# Altium schematic sheet AUAV-X1_POWER_R1.SchDoc
size A4; PageSetup: Record=PageOptions|CenterHorizontal=True|CenterVertical=True|PrintScale=0.97|XCorrection=1.00|YCorrection=1.00|PrintKind=2|BorderSize=5000000|LeftOffset=0|BottomOffset=0|Orientation=2|PaperLength=1000|PaperWidth=1000|Scale=100|PaperSource=267|PrintQuality=-4|MediaType=1|DitherType=1|PaperKind=A4|PrintScaleMode=1
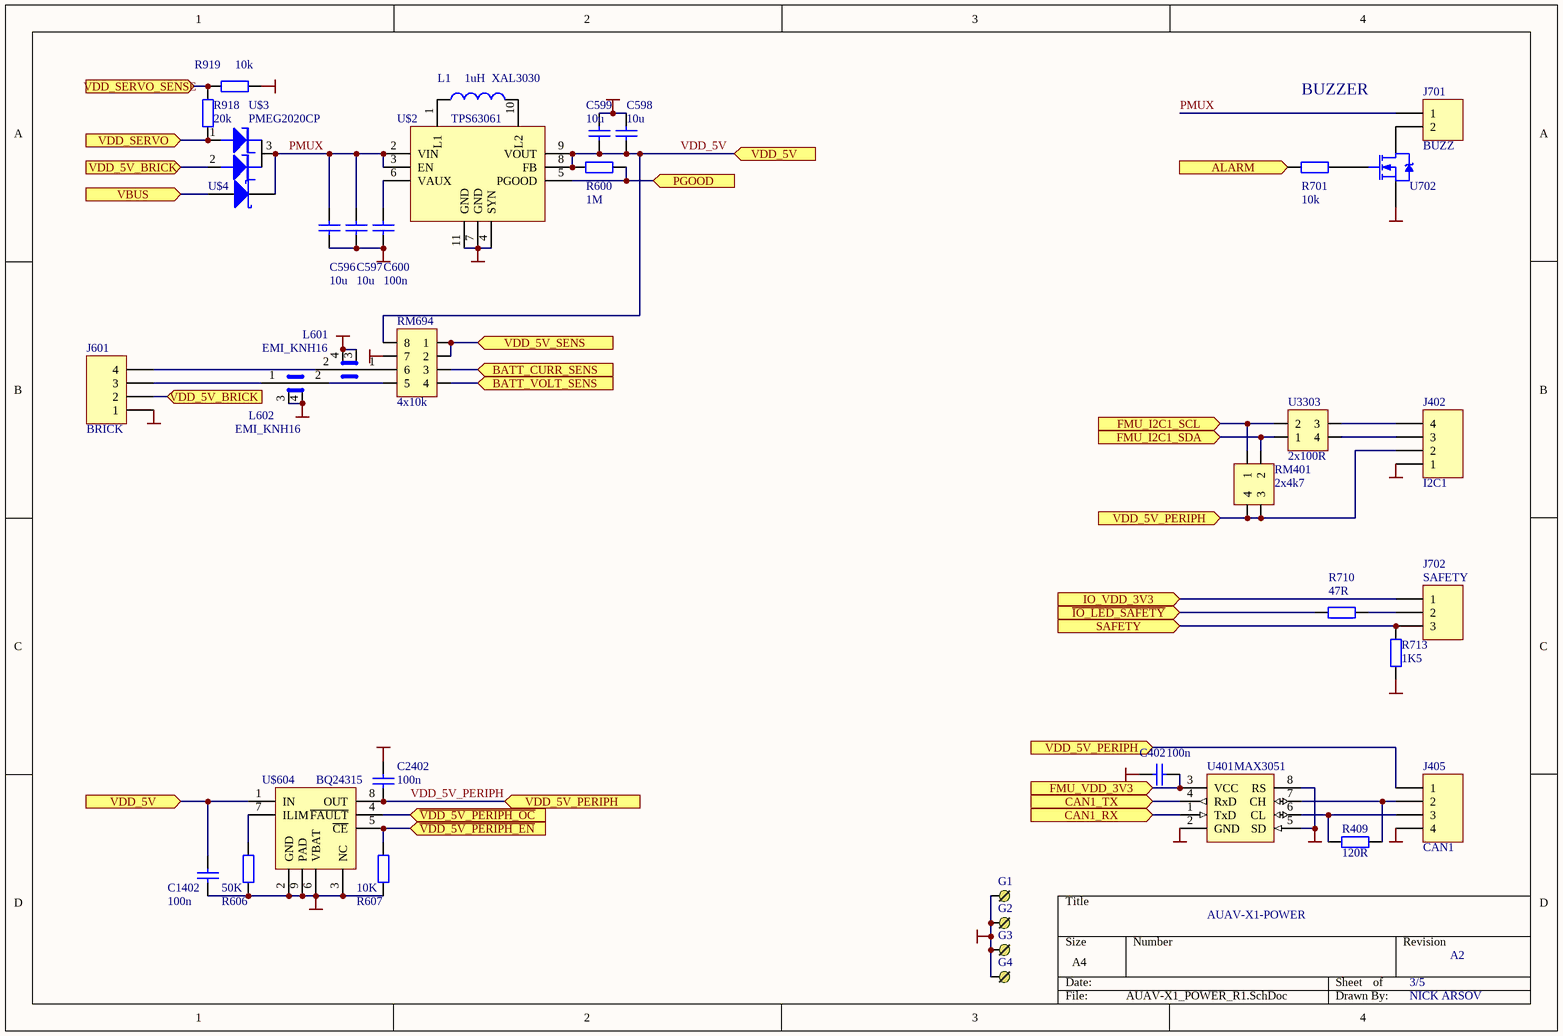
[diagram p0: AUAV-X1_POWER_R1.SchDoc]

## Parts
C402  100n  [0402A]
C596  10u  [0805A]
C597  10u  [0805A]
C598  10u  [0805A]
C599  10u  [0805A]
C600  100n  [0402A]
C1402  100n  [0402A]
C2402  100n  [0402A]
G1  PLUG  [SMT_PAD_ROUND]  (value not drawn)
G2  PLUG  [SMT_PAD_ROUND]  (value not drawn)
G3  PLUG  [SMT_PAD_ROUND]  (value not drawn)
G4  PLUG  [SMT_PAD_ROUND]  (value not drawn)
J402  I2C1  [HDR1X4]
J405  CAN1  [HDR1X4]
J601  BRICK  [HDR1X4]
J701  BUZZ  [HDR1X2]
J702  SAFETY  [HDR1X3]
L1  XAL3030  value 1uH  [XAL4040]
L601  EMI_KNH16  [EMI_KNH16_0603]
L602  EMI_KNH16  [EMI_KNH16_0603]
R409  120R  [0603A]
R600  1M  [0402A]
R606  50K  [0402A]
R607  10K  [0402A]
R701  10k  [0402A]
R710  47R  [0402A]
R713  1K5  [0402A]
R918  20k  [0402A]
R919  10k  [0402A]
RM401  2x4k7  [RM2_0804]
RM694  4x10k  [RM4_0804]
U401  MAX3051  [SOT-23-8]
U702  ZXMN2F34MA  [2N7002-SOT323]  (value not drawn)
U3303  2x100R  [RM2_0804]
U$2  TPS63061  [TPS63061]
U$3  PMEG2020CP  [pmeg2020cp]
U$4  D Schottky  [SOD323F]  (value not drawn)
U$604  BQ24315  [BQ24315]

## Ports
ALARM, BATT_CURR_SENS, BATT_VOLT_SENS, CAN1_RX, CAN1_TX, FMU_I2C1_SCL, FMU_I2C1_SDA, FMU_VDD_3V3, IO_VDD_3V3, PGOOD, SAFETY, VBUS, VDD_5V, VDD_5V_BRICK, VDD_5V_PERIPH, VDD_5V_SENS, VDD_SERVO, VDD_SERVO_SENSE, ~{IO_LED_SAFETY}, ~{VDD_5V_PERIPH_EN}, ~{VDD_5V_PERIPH_OC}

## Nets
GND: C402.1 C596.1 C597.1 C598.1 C599.1 C600.1 C1402.1 C2402.1 G1.1 G2.1 G3.1 G4.1 J402.1 J405.4 J601.1 L601.3(G) L601.4(G) L602.3(G) L602.4(G) R606.1 R607.1 R713.2 R919.2 RM694.7 U401.2(GND) U401.5(SD) U401.8(RS) U702.2(S) U$2.4(SYN) U$2.7(GND) U$2.11(GND) U$604.2(GND) U$604.3(NC) U$604.6(VBAT) U$604.9(PAD)
~{IO_LED_SAFETY}: R710.2 ; port ~{IO_LED_SAFETY}
~{VDD_5V_PERIPH_EN}: R607.2 U$604.5(~{CE}) ; port ~{VDD_5V_PERIPH_EN}
~{VDD_5V_PERIPH_OC}: U$604.4(~{FAULT}) ; port ~{VDD_5V_PERIPH_OC}
ALARM: R701.1 ; port ALARM
BATT_CURR_SENS: RM694.3 ; port BATT_CURR_SENS
BATT_VOLT_SENS: RM694.4 ; port BATT_VOLT_SENS
CAN1_RX: U401.1(TxD) ; port CAN1_RX
CAN1_TX: U401.4(RxD) ; port CAN1_TX
FMU_I2C1_SCL: RM401.1 U3303.2 ; port FMU_I2C1_SCL
FMU_I2C1_SDA: RM401.2 U3303.1 ; port FMU_I2C1_SDA
FMU_VDD_3V3: C402.2 U401.3(VCC) ; port FMU_VDD_3V3
IO_VDD_3V3: J702.1 ; port IO_VDD_3V3
PGOOD: R600.2 U$2.5(PGOOD) ; port PGOOD
PMUX: C596.2 C597.2 J701.1 U$2.2(VIN) U$2.3(EN) U$3.3 U$4.2(K)
SAFETY: J702.3 R713.1 ; port SAFETY
VBUS: U$4.1(A) ; port VBUS
VDD_5V: C598.2 C599.2 C1402.2 R600.1 RM694.8 U$2.8(FB) U$2.9(VOUT) U$604.1(IN) ; port VDD_5V
VDD_5V_BRICK: J601.2 U$3.2 ; port VDD_5V_BRICK
VDD_5V_PERIPH: C2402.2 J402.2 J405.1 RM401.3 RM401.4 U$604.8(OUT) ; port VDD_5V_PERIPH
VDD_5V_SENS: RM694.1 RM694.2 ; port VDD_5V_SENS
VDD_SERVO: R918.2 U$3.1 ; port VDD_SERVO
VDD_SERVO_SENSE: R918.1 R919.1 ; port VDD_SERVO_SENSE
NetC600_2: C600.2 U$2.6(VAUX)
NetJ402_3: J402.3 U3303.4
NetJ402_4: J402.4 U3303.3
NetJ405_2: J405.2 R409.1 U401.7(CH)
NetJ405_3: J405.3 R409.2 U401.6(CL)
NetJ601_3: J601.3 L602.1(L1)
NetJ601_4: J601.4 L601.2(L2)
NetJ701_2: J701.2 U702.1(D)
NetJ702_2: J702.2 R710.1
NetL1_1: L1.1 U$2.1(L1)
NetL1_2: L1.2 U$2.10(L2)
NetL601_1: L601.1(L1) RM694.6
NetL602_2: L602.2(L2) RM694.5
NetR606_2: R606.2 U$604.7(ILIM)
NetR701_2: R701.2 U702.3(G)

## Notes on the sheet
- BUZZER
- AUAV-X1-POWER
- 3/5
- A2
- NICK ARSOV

## Library data of the parts
C402 C596-C600 C1402 C2402 = Cap: Capacitor; Value: 100pF; Published: 8-Jun-2000; LatestRevisionDate: 17-Jul-2002; LatestRevisionNote: Re-released for DXP Platform.; PackageReference: RAD-0.3; Publisher: Altium Limited
J402 J405 J601 = Header 4: Header, 4-Pin; LatestRevisionDate: 17-Jul-2002; LatestRevisionNote: Re-released for DXP Platform.; Publisher: Altium Limited
J701 = Header 2: Header, 2-Pin; LatestRevisionDate: 17-Jul-2002; LatestRevisionNote: Re-released for DXP Platform.; Publisher: Altium Limited
J702 = Header 3: Header, 3-Pin; LatestRevisionDate: 17-Jul-2002; LatestRevisionNote: Re-released for DXP Platform.; Publisher: Altium Limited
L1 = Inductor: Code_IEC: 1005; Published: 8-Jun-2000; LatestRevisionDate: 17-Jul-2002; LatestRevisionNote: Re-released for DXP Platform.; PackageReference: 0402-A; Publisher: Altium Limited; Code_JEITA: 0402
L601 L602 = EMI_KNH10
R409 R600 R606 R607 R701 R710 R713 R918 R919 = Res2: Resistor; Value: 1K; Published: 8-Jun-2000; LatestRevisionDate: 17-Jul-2002; LatestRevisionNote: Re-released for DXP Platform.; PackageReference: AXIAL-0.4; Publisher: Altium Limited
RM401 U3303 = RES_SMD_2
RM694 = RES_SMD_4
U702 = NMOS-2: N-Channel Power MOSFET; Note: Pin 2 is electrically connected to pin 4.; Published: 8-Jun-2000; LatestRevisionDate: 17-Jul-2002; LatestRevisionNote: Re-released for DXP Platform.; DatasheetDocument: PD-9.814; PackageReference: TO-220AB; Publisher: Altium Limited; Code_JEDEC: TO-220-AB; ComponentLink1Description: Manufacturer Link; ComponentLink1URL: http://www.irf.com/
U$4 = D Schottky: Schottky Diode; Published: 8-Jun-2000; LatestRevisionDate: 17-Jul-2002; LatestRevisionNote: Re-released for DXP Platform.; PackageReference: SMB; Publisher: Altium Limited; Code_JEDEC: DO-214-AA